# EAGLE board Reach_B0 (EAGLE 8.4.2)
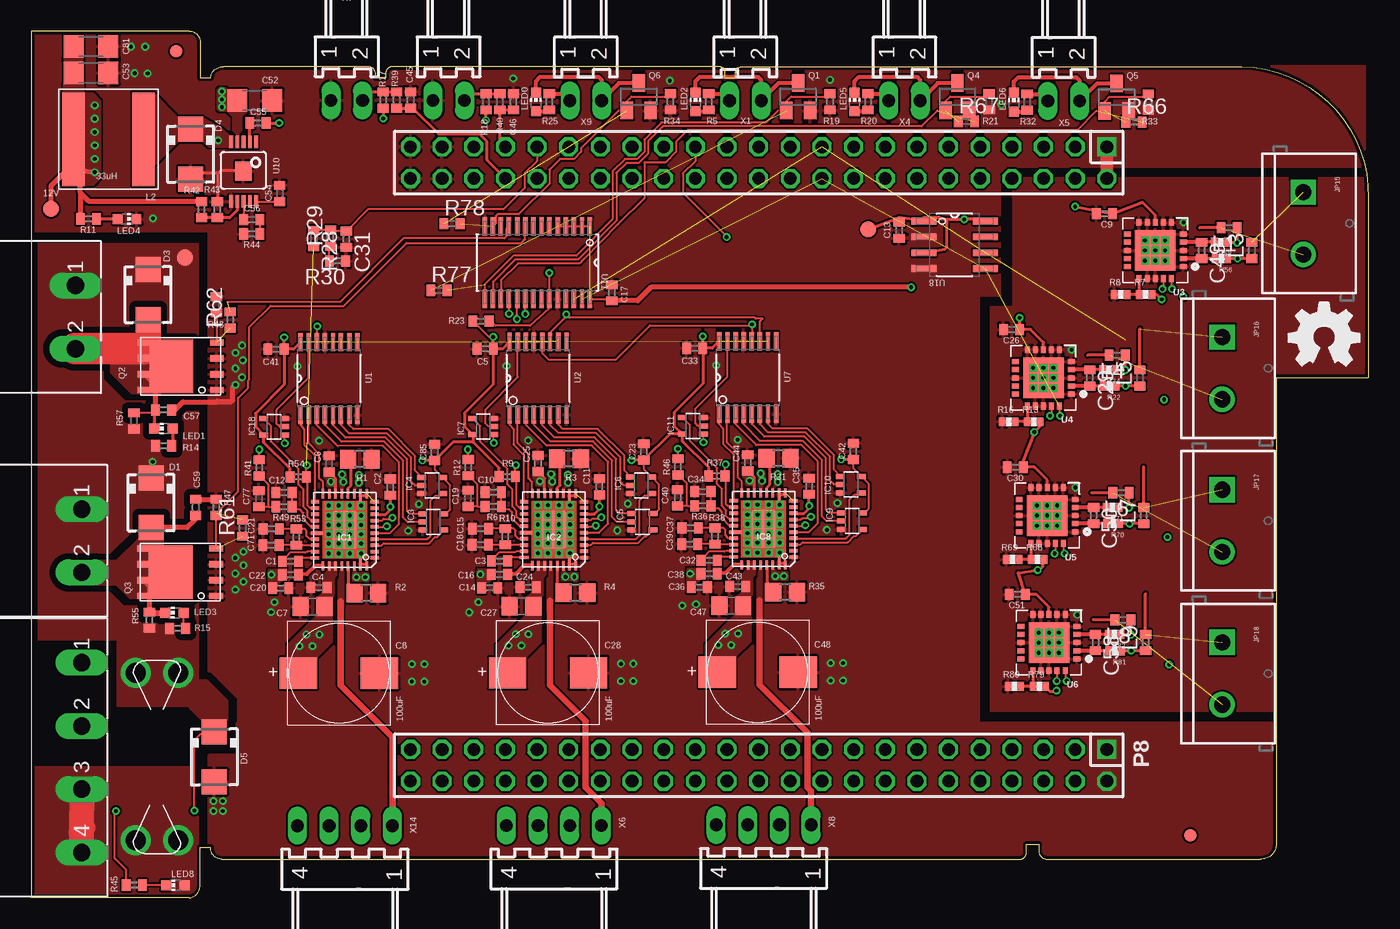
[diagram p5: board, top side]
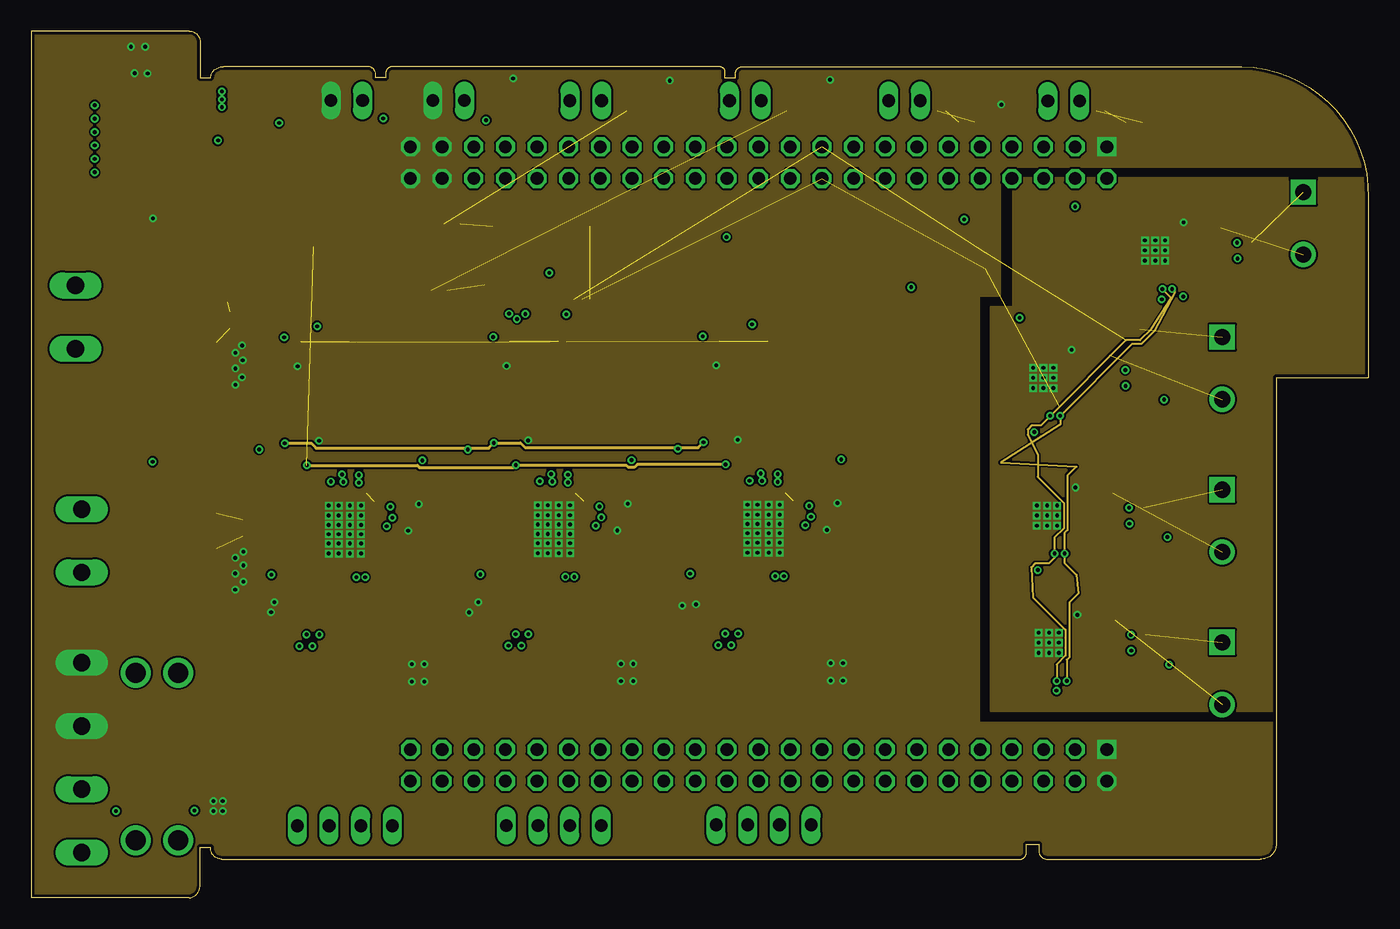
[diagram p6: board, inner layer GND]
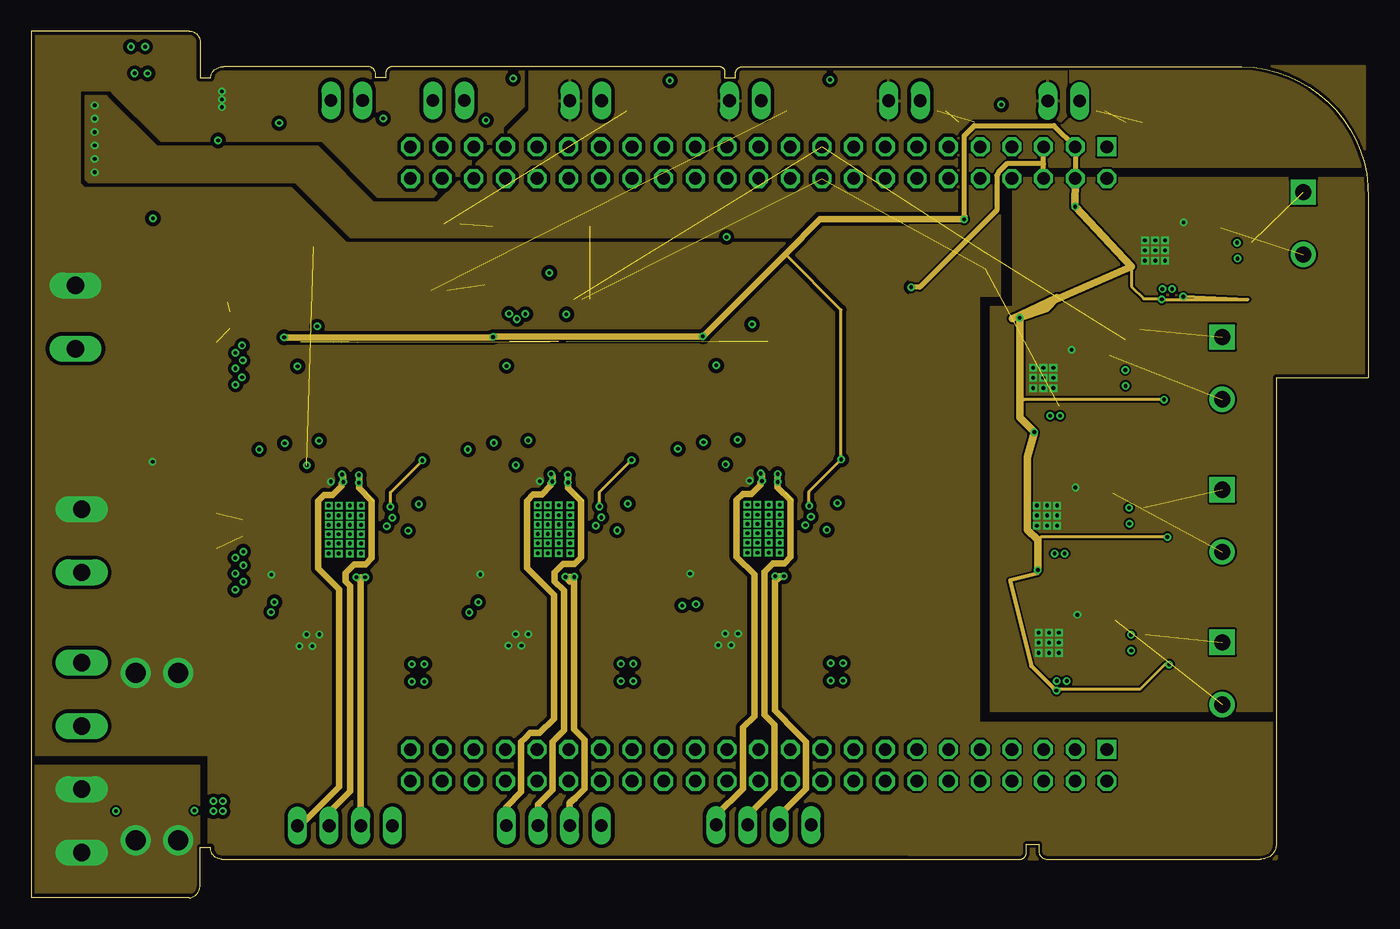
[diagram p7: board, inner layer VCC]
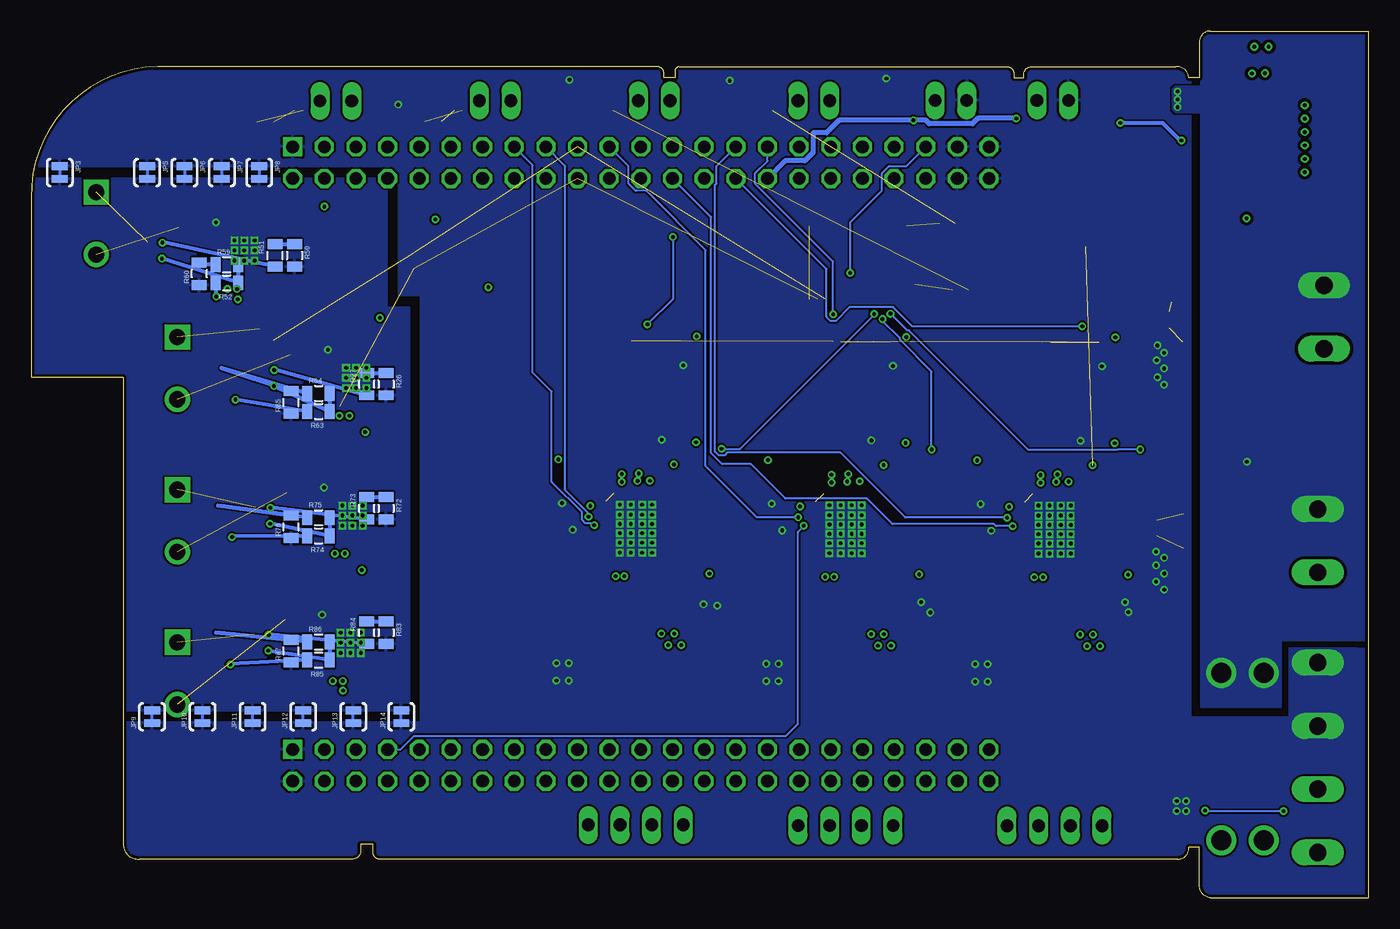
[diagram p8: board, bottom side, seen from below]

Size 107.3 x 69.55 mm. Coordinates in mm from the lower left corner, seen from the top.
Outline: 13.55,4.05 14.4,4.05 14.4,3.95 arc90 15.3,3.1 79.45,3.1 arc90 79.85,3.75 79.85,4.3 80.85,4.3 80.85,3.85 arc90 81.45,3.1 98.65,3.1 arc90 99.9,4.2 99.9,41.75 107.3,41.75 107.3,56.2 arc90 97.15,66.7 57.02,66.7 arc90 56.52,66.15 56.52,65.8 55.65,65.8 55.65,66.3 arc90 55.3,66.7 29,66.7 arc90 28.45,66.2 28.45,65.8 27.65,65.8 27.65,66.05 arc90 27.05,66.7 15.45,66.7 arc90 14.4,65.8 13.55,65.8 13.55,68.75 arc90 12.7,69.55 0,69.55 0,0 12.7,0 arc90 13.55,1.05 13.55,4.05
Copper layers (1*2*3*16): Top 0.035mm / dielectric 0.2mm / GND 0.035mm / dielectric 1.1mm / VCC 0.035mm / dielectric 0.2mm / Bottom 0.035mm
Design rules "default *": minimum track width 6mil, minimum drill 0.3mm, track to track 6mil, track to pad 6mil, pad to pad 6mil, via to via 6mil, smd to smd 0mil, copper to edge 10mil, drill to drill 10mil, minimum pad ring 10mil, minimum via ring 6mil, stop-mask expansion 2mil, vias tented up to drill 100mil, thermal gap 8mil
Net classes: 1 power: width 1.27 mm; 2 Stepper: width 0.508 mm, clearance 0.305 mm

## Footprints (pad centres in the part's own frame; a part is rotated, then mirrored left to right if it is on the bottom)
B1,27 = smd 1.27 x 1.27: TP 0,0
C0402 = smd 0.7 x 0.9: 1 -0.65,0; 2 0.65,0
C0805 = smd 1.3 x 1.5: 1 -0.95,0; 2 0.95,0
RHS1V10MCN1GS = smd 3 x 2.5: + -3.25,0; - 3.25,0
C1206 = smd 1.6 x 1.8: 1 -1.4,0; 2 1.4,0
SMA = smd 2 x 2: A 2,0; C -2,0
3557 = drill 1.6: P$1 -6.73,1.7; P$2 -6.73,-1.7; P$3 6.73,-1.7; P$4 6.73,1.7
QFN36 = smd 0.7 x 0.25: 1 -2.4,2.25; 2 -2.4,1.75; 3 -2.4,1.25; 4 -2.4,0.75; 5 -2.4,0.25; 6 -2.4,-0.25; 7 -2.4,-0.75; 8 -2.4,-1.25; 9 -2.4,-1.75; 10 -2.4,-2.25; 19 2.4,-2.25; 20 2.4,-1.75; 21 2.4,-1.25; 22 2.4,-0.75; 23 2.4,-0.25; 25 2.4,0.75; 26 2.4,1.25; 27 2.4,1.75; 28 2.4,2.25 | smd 0.25 x 0.7: 11 -1.75,-2.9; 13 -0.75,-2.9; 14 -0.25,-2.9; 15 0.25,-2.9; 16 0.75,-2.9; 17 1.25,-2.9; 18 1.75,-2.9; 29 1.75,2.9; 30 1.25,2.9; 31 0.75,2.9; 32 0.25,2.9; 33 -0.25,2.9; 34 -0.75,2.9; 36 -1.75,2.9 | smd 0.25 x 1: 12 -1.25,-2.75; 35 -1.25,2.75 | smd 1 x 0.25: 24 2.25,0.25 | smd 2 x 3: TP 0,0
SC70-5 = smd 0.4 x 0.7: 1 -0.65,-0.85; 2 0,-0.85; 3 0.65,-0.85; 4 0.65,0.85; 5 -0.65,0.85
FIDUCIAL-1X2.5 = smd 1 x 1: 1 0,0
PAD-JUMPER-2-NC_BY_TRACE_YES_SILK = smd 0.635 x 1.27: 1 -0.508,0; 2 0.508,0
SCREWTERMINAL-5MM-2 = drill 1.3 pad 2.032 square: 1 0,0 | drill 1.3 pad 2.032: 2 5,0
0402 = smd 0.7 x 0.9: 1 -0.65,0; 2 0.65,0
NR8040T330 = smd 1.8 x 7.5: P$1 2.8,0; P$2 -2.8,0
CHIP-LED0603 = smd 0.8 x 0.8: A 0,-0.75; C 0,0.75
DIL-100-2X23 = drill 1.016 square: 1 -27.94,-1.27 | drill 1.016 octagon: 2 -27.94,1.27; 3 -25.4,-1.27; 4 -25.4,1.27; 5 -22.86,-1.27; 6 -22.86,1.27; 7 -20.32,-1.27; 8 -20.32,1.27; 9 -17.78,-1.27; 10 -17.78,1.27; 11 -15.24,-1.27; 12 -15.24,1.27; 13 -12.7,-1.27; 14 -12.7,1.27; 15 -10.16,-1.27; 16 -10.16,1.27; 17 -7.62,-1.27; 18 -7.62,1.27; 19 -5.08,-1.27; 20 -5.08,1.27; 21 -2.54,-1.27; 22 -2.54,1.27; 23 0,-1.27; 24 0,1.27; 25 2.54,-1.27; 26 2.54,1.27; 27 5.08,-1.27; 28 5.08,1.27; 29 7.62,-1.27; 30 7.62,1.27; 31 10.16,-1.27; 32 10.16,1.27; 33 12.7,-1.27; 34 12.7,1.27; 35 15.24,-1.27; 36 15.24,1.27; 37 17.78,-1.27; 38 17.78,1.27; 39 20.32,-1.27; 40 20.32,1.27; 41 22.86,-1.27; 42 22.86,1.27; 43 25.4,-1.27; 44 25.4,1.27; 45 27.94,-1.27; 46 27.94,1.27
SOT23 = smd 1 x 1.4: 1 -0.95,-1.1; 2 0.95,-1.1; 3 0,1.1
8-DFN-EP-(5X6) = smd 1.1 x 0.5: 1 -2.9,1.905; 2 -2.9,0.635; 3 -2.9,-0.635; 4 -2.9,-1.905; 5 2.9,-1.905; 6 2.9,-0.635; 7 2.9,0.635; 8 2.9,1.905 | smd 3.5 x 4.3: TH 0.75,0
R0805 = smd 1.3 x 1.5: 1 -0.95,0; 2 0.95,0
R0402 = smd 0.7 x 0.9: 1 -0.65,0; 2 0.65,0
0402-RES = smd 0.6 x 0.7: 1 -0.508,0; 2 0.508,0
0805 = smd 0.8 x 1.2: 1 -0.9,0; 2 0.9,0
SOP65P640X120-16N = smd 1.473 x 0.356: 1 -2.921,2.286; 2 -2.921,1.626; 3 -2.921,0.965; 4 -2.921,0.33; 5 -2.921,-0.33; 6 -2.921,-0.965; 7 -2.921,-1.626; 8 -2.921,-2.286; 9 2.921,-2.286; 10 2.921,-1.626; 11 2.921,-0.965; 12 2.921,-0.33; 13 2.921,0.33; 14 2.921,0.965; 15 2.921,1.626; 16 2.921,2.286
MQFN-20 = smd 0.55 x 0.4: P$1 -2.25,1.3; P$2 -2.25,0.65; P$3 -2.25,0; P$4 -2.25,-0.65; P$5 -2.25,-1.3; P$11 2.25,-1.3; P$12 2.25,-0.65; P$13 2.25,0; P$14 2.25,0.65; P$15 2.25,1.3 | smd 0.4 x 0.55: P$6 -1.3,-2.25; P$7 -0.65,-2.25; P$8 0,-2.25; P$9 0.65,-2.25; P$10 1.3,-2.25; P$16 1.3,2.25; P$17 0.65,2.25; P$18 0,2.25; P$19 -0.65,2.25; P$20 -1.3,2.25 | smd 3.25 x 3.25: P$21 0,0
MSOP10 = smd 0.3 x 1: 1 -1,-2.4; 2 -0.5,-2.4; 3 0.005,-2.4; 4 0.5,-2.4; 5 1,-2.4; 6 1,2.4; 7 0.5,2.4; 8 0.005,2.4; 9 -0.5,2.4; 10 -1,2.4 | smd 1.3 x 1.5: EP 0.02,-0.04
SOP65P640X110-28N = smd 1.473 x 0.356: 1 -2.921,4.216; 2 -2.921,3.581; 3 -2.921,2.921; 4 -2.921,2.286; 5 -2.921,1.626; 6 -2.921,0.965; 7 -2.921,0.33; 8 -2.921,-0.33; 9 -2.921,-0.965; 10 -2.921,-1.626; 11 -2.921,-2.286; 12 -2.921,-2.921; 13 -2.921,-3.581; 14 -2.921,-4.216; 15 2.921,-4.216; 16 2.921,-3.581; 17 2.921,-2.921; 18 2.921,-2.286; 19 2.921,-1.626; 20 2.921,-0.965; 21 2.921,-0.33; 22 2.921,0.33; 23 2.921,0.965; 24 2.921,1.626; 25 2.921,2.286; 26 2.921,2.921; 27 2.921,3.581; 28 2.921,4.216
SOIC127P600X175-8N = smd 1.981 x 0.533: 1 -2.464,1.905; 2 -2.464,0.635; 3 -2.464,-0.635; 4 -2.464,-1.905; 5 2.464,-1.905; 6 2.464,-0.635; 7 2.464,0.635; 8 2.464,1.905
7395-02 = drill 1.016 long: 1 1.27,0; 2 -1.27,0
MSTBA4 = drill 1.397 long: 1 -7.62,5.08; 2 -2.54,5.08; 3 2.54,5.08; 4 7.62,5.08
MSTBA2 = drill 1.397 long: 1 -2.54,5.08; 2 2.54,5.08
7395-04 = drill 1.016 long: 1 3.81,0; 2 1.27,0; 3 -1.27,0; 4 -3.81,0

## Placement (x,y rotation side)
3.3V  TPB1,27  [B1,27]  67.17,53.65 0 top
12..24V  TPB1,27  [B1,27]  12.32,51.38 90 top
12V  TPB1,27  [B1,27]  1.6,55.27 0 top
C1  22nF  [C0402]  20.8,27 180 top
C2  0.1uF  [C0402]  28.82,32.95 90 top
C3  22nF  [C0402]  37.58,27.02 180 top
C4  0.1uF  [C0402]  23.1,24.9 180 top
C5  0.1uF  [C0402]  36.42,44.05 180 top
C6  0.1uF  [C0402]  23.9,34.83 90 top
C7  10uF  [C0805]  22.57,23.38 180 top
C8  100uF  [RHS1V10MCN1GS]  24.7,18.02 0 top
C9  0.1uF  [C0402]  86.12,54.9 180 top
C10  4.7uF  [C0402]  37.08,32.55 180 top
C11  0.1uF  [C0402]  45.6,32.98 90 top
C12  4.7uF  [C0402]  20.3,32.52 180 top
C13  0.1uF  [C0402]  69.65,53.58 270 top
C14  0.1uF  [C0402]  36.8,24.88 180 top
C15  4.7uF  [C0402]  36.05,29.62 0 top
C16  0.1uF  [C0402]  37.58,25.95 180 top
C17  0.1uF  [C0402]  46.59,48.55 90 top
C18  0.1uF  [C0402]  36.02,28.32 180 top
C19  4.7uF  [C0402]  35.05,32.05 90 top
C20  0.1uF  [C0402]  20.02,24.85 180 top
C21  4.7uF  [C0402]  19.27,29.6 0 top
C22  0.1uF  [C0402]  20.8,25.93 180 top
C23  0.1uF  [C0402]  49.15,35.77 90 top
C24  0.1uF  [C0402]  39.88,24.93 180 top
C25  0.1uF  [C0402]  40.67,34.85 90 top
C26  0.1uF  [C0402]  78.67,45.6 180 top
C27  10uF  [C0805]  39.35,23.4 180 top
C28  100uF  [RHS1V10MCN1GS]  41.48,18.05 0 top
C29  0.1uF  [C0402]  84.95,41.73 270 top
C30  0.1uF  [C0402]  78.97,34.55 180 top
C31  4.7uF  [C0402]  25.3,52.85 270 top
C32  22nF  [C0402]  54.4,27.07 180 top
C33  0.1uF  [C0402]  53.25,44.1 180 top
C34  4.7uF  [C0402]  53.9,32.6 180 top
C35  0.1uF  [C0402]  62.42,33.02 90 top
C36  0.1uF  [C0402]  53.62,24.93 180 top
C37  4.7uF  [C0402]  52.88,29.68 0 top
C38  0.1uF  [C0402]  54.4,26 180 top
C39  0.1uF  [C0402]  52.85,28.38 180 top
C40  4.7uF  [C0402]  51.88,32.1 90 top
C41  0.1uF  [C0402]  19.65,44.02 180 top
C42  0.1uF  [C0402]  65.97,35.83 90 top
C43  0.1uF  [C0402]  56.7,24.98 180 top
C44  0.1uF  [C0402]  57.5,34.9 90 top
C45  4.7uF  [C0402]  30.45,64.03 90 top
C46  4.7uF  [C0402]  38.7,63.88 90 top
C47  10uF  [C0805]  56.17,23.45 180 top
C48  100uF  [RHS1V10MCN1GS]  58.3,18.1 0 top
C49  0.1uF  [C0402]  93.92,51.95 270 top
C50  0.1uF  [C0402]  85.25,30.68 270 top
C51  0.1uF  [C0402]  79.12,24.35 180 top
C52  10uF  [C1206]  17.95,63.98 0 top
C53  10uF  [C1206]  4.8,66.2 0 top
C54  10nF  [C0402]  19.95,56.52 90 top
C55  10nF  [C0402]  18.2,62.17 0 top
C56  1nF  [C0402]  17.7,54.42 0 top
C57  4.7nF  [C0402]  10.62,39.15 0 top
C58  0.1uF  [C0402]  85.4,20.48 270 top
C59  4.7nF  [C0402]  13.2,31.32 90 top
C71  0.1uF  [C0402]  19.25,28.3 180 top
C77  4.7uF  [C0402]  18.27,32.02 90 top
C81  10uF  [C1206]  4.8,68.33 0 top
C85  0.1uF  [C0402]  32.38,35.75 90 top
D1  MBRA340T3  [SMA]  9.62,31.7 270 top
D3  MBRA340T3  [SMA]  9.38,48.4 270 top
D4  MBRA340T3  [SMA]  12.8,59.67 270 top
D5  MBRA340T3  [SMA]  14.7,11.3 270 top
F1  FUSE  [3557]  10.1,11.33 90 top
IC1  TMC2130QFN36  [QFN36]  25.18,29.52 180 top
IC2  TMC2130QFN36  [QFN36]  41.95,29.55 180 top
IC3  74AHC1G126DCK  [SC70-5]  32.27,30.15 270 top
IC4  74AHC1G126DCK  [SC70-5]  32.17,33.08 270 top
IC5  74AHC1G126DCK  [SC70-5]  49.05,30.18 270 top
IC6  74AHC1G126DCK  [SC70-5]  48.95,33.1 270 top
IC7  74AHC1G126DCK  [SC70-5]  36.27,37.83 90 top
IC8  TMC2130QFN36  [QFN36]  58.77,29.6 180 top
IC9  74AHC1G126DCK  [SC70-5]  65.88,30.23 270 top
IC10  74AHC1G126DCK  [SC70-5]  65.78,33.15 270 top
IC11  74AHC1G126DCK  [SC70-5]  53.1,37.88 90 top
IC18  74AHC1G126DCK  [SC70-5]  19.5,37.8 90 top
JP1  FIDUCIAL1X2.5  [FIDUCIAL-1X2.5]  11.62,67.92 0 top
JP2  FIDUCIAL1X2.5  [FIDUCIAL-1X2.5]  93,5 0 top
JP3  [PAD-JUMPER-2-NC_BY_TRACE_YES_SILK]  105,58.2 270 bottom
JP5  [PAD-JUMPER-2-NC_BY_TRACE_YES_SILK]  98,58.2 270 bottom
JP6  [PAD-JUMPER-2-NC_BY_TRACE_YES_SILK]  95,58.2 270 bottom
JP7  [PAD-JUMPER-2-NC_BY_TRACE_YES_SILK]  92,58.2 270 bottom
JP8  [PAD-JUMPER-2-NC_BY_TRACE_YES_SILK]  89,58.2 270 bottom
JP9  [PAD-JUMPER-2-NC_BY_TRACE_YES_SILK]  97.6,14.53 90 bottom
JP10  [PAD-JUMPER-2-NC_BY_TRACE_YES_SILK]  93.55,14.53 90 bottom
JP11  [PAD-JUMPER-2-NC_BY_TRACE_YES_SILK]  89.53,14.53 90 bottom
JP12  [PAD-JUMPER-2-NC_BY_TRACE_YES_SILK]  85.47,14.53 90 bottom
JP13  [PAD-JUMPER-2-NC_BY_TRACE_YES_SILK]  81.45,14.53 90 bottom
JP14  [PAD-JUMPER-2-NC_BY_TRACE_YES_SILK]  77.6,14.53 90 bottom
JP15  [SCREWTERMINAL-5MM-2]  102.08,56.62 270 top
JP16  [SCREWTERMINAL-5MM-2]  95.58,45 270 top
JP17  [SCREWTERMINAL-5MM-2]  95.58,32.75 270 top
JP18  [SCREWTERMINAL-5MM-2]  95.58,20.5 270 top
L1  BLM15HB121SN1  [0402]  96.12,53.77 180 top
L2  33uH  [NR8040T330]  6.2,60.88 180 top
L3  BLM15HB121SN1  [0402]  97.95,51.95 90 top
L4  BLM15HB121SN1  [0402]  87.15,43.55 180 top
L5  BLM15HB121SN1  [0402]  88.97,41.73 90 top
L6  BLM15HB121SN1  [0402]  87.45,32.5 180 top
L7  BLM15HB121SN1  [0402]  89.28,30.68 90 top
L8  BLM15HB121SN1  [0402]  87.6,22.3 180 top
L9  BLM15HB121SN1  [0402]  89.42,20.48 90 top
LED0  blue  [CHIP-LED0603]  40.5,63.88 0 top
LED1  blue  [CHIP-LED0603]  10.62,37.65 90 top
LED2  blue  [CHIP-LED0603]  53.3,63.88 0 top
LED3  blue  [CHIP-LED0603]  11.5,22.88 90 top
LED4  blue  [CHIP-LED0603]  7.7,54.48 270 top
LED5  blue  [CHIP-LED0603]  66.08,63.88 0 top
LED6  blue  [CHIP-LED0603]  78.85,63.85 0 top
LED8  blue  [CHIP-LED0603]  11.57,1 90 top
LOGO1  OSHW_LOGO_FILLX0200-NT  [OSHW_FILLX200_NOTEXT]  100.91,42.71 0 top
P8  F-2X23-  [DIL-100-2X23]  58.38,10.62 180 top
P9  F-2X23-  [DIL-100-2X23]  58.38,59 180 top
Q1  [SOT23]  61.55,64.28 0 top
Q2  AON6758  [8-DFN-EP-(5X6)]  12,42.65 180 top
Q3  AON6758  [8-DFN-EP-(5X6)]  11.95,26.12 180 top
Q4  [SOT23]  74.33,64.28 0 top
Q5  [SOT23]  87.1,64.25 0 top
Q6  [SOT23]  48.75,64.28 0 top
R1  0.1R  [R0805]  26.38,35.2 180 top
R2  0.1R  [R0805]  26.9,24.45 180 top
R3  0.1R  [R0805]  43.15,35.23 180 top
R4  0.1R  [R0805]  43.67,24.48 180 top
R5  4.7K  [R0402]  54.38,63.88 90 top
R6  10K  [R0402]  37.08,31.4 180 top
R7  DNP  [0402-RES]  89.42,48.42 0 top
R8  0  [0402-RES]  87.42,48.42 0 top
R9  4.7K  [R0402]  38.2,33.8 180 top
R10  2.2R  [R0402]  38.05,28.98 270 top
R11  4.7K  [R0402]  4.6,54.48 180 top
R12  10K  [R0402]  35.08,34.52 90 top
R13  10k  [0402-RES]  80.45,38.2 0 top
R14  4.7K  [R0402]  10.62,36.27 180 top
R15  4.7K  [R0402]  11.75,21.62 180 top
R16  2.2k  [0402-RES]  78.45,38.2 0 top
R17  4K7, 1%  [R0402]  28.25,64.03 270 top
R18  4K7, 1%  [R0402]  36.5,63.88 270 top
R19  4.7K  [R0402]  64.1,63.88 90 top
R20  4.7K  [R0402]  67.15,63.88 90 top
R21  4.7K  [R0402]  76.88,63.88 90 top
R22  100  [0402-RES]  86.53,41.08 180 top
R23  4.7K  [R0402]  36.1,46.27 180 top
R24  100  [0402-RES]  86.47,42.38 180 top
R25  4.7K  [R0402]  41.58,63.88 90 top
R26  10k  [0805]  78.83,41.23 270 bottom
R27  10k  [0805]  80.38,41.23 90 bottom
R28  10k  [R0402]  22.68,52.9 270 top
R29  7.5k  [R0402]  24.02,52.92 90 top
R30  4.3k  [R0402]  24.57,51.1 180 top
R31  0.1R  [R0805]  59.98,35.27 180 top
R32  4.7K  [R0402]  79.92,63.85 90 top
R33  4.7K  [R0402]  89.65,63.85 90 top
R34  4.7K  [R0402]  51.3,63.88 90 top
R35  0.1R  [R0805]  60.5,24.52 180 top
R36  10K  [R0402]  53.9,31.45 180 top
R37  4.7K  [R0402]  55.02,33.85 180 top
R38  2.2R  [R0402]  54.88,29.02 270 top
R39  10K  [R0402]  29.32,64.03 270 top
R40  10K  [R0402]  37.6,63.88 270 top
R41  10K  [R0402]  18.3,34.5 90 top
R42  120K,1%  [R0402]  13.68,55.23 270 top
R43  10K,1%  [R0402]  14.95,55.23 90 top
R44  39K  [R0402]  17.7,53.27 180 top
R45  4.7K  [R0402]  8.28,1.02 0 top
R46  10K  [R0402]  51.9,34.58 90 top
R47  4.7K  [R0402]  14.85,31.32 270 top
R48  4.7K  [R0402]  14.88,47.6 270 top
R49  10K  [R0402]  20.3,31.38 180 top
R50  10k  [0805]  86.17,51.55 270 bottom
R51  10k  [0805]  87.72,51.55 90 bottom
R52  10k  [0805]  91.6,49.35 0 bottom
R53  2.2R  [R0402]  21.27,28.95 270 top
R54  4.7K  [R0402]  21.43,33.77 180 top
R55  4.7K  [R0402]  9.5,22.27 270 top
R56  100  [0402-RES]  95.5,51.3 180 top
R57  4.7K  [R0402]  8.25,38.27 270 top
R58  100  [0402-RES]  95.45,52.6 180 top
R59  10k  [0805]  91.6,50.8 0 bottom
R60  10k  [0805]  93.8,50.08 90 bottom
R61  330  [R0402]  16.98,29.68 90 top
R62  330  [R0402]  15.97,46.38 90 top
R63  10k  [0805]  84.25,39.02 0 bottom
R64  10k  [0805]  84.25,40.48 0 bottom
R65  10k  [0805]  86.45,39.75 90 bottom
R66  330  [R0402]  88.5,62.25 0 top
R67  330  [R0402]  75.05,62.3 0 top
R68  10k  [0402-RES]  80.75,27.15 0 top
R69  4.3k  [0402-RES]  78.75,27.15 0 top
R70  100  [0402-RES]  86.83,30.02 180 top
R71  100  [0402-RES]  86.78,31.32 180 top
R72  10k  [0805]  78.83,31.25 270 bottom
R73  10k  [0805]  80.38,31.25 90 bottom
R74  10k  [0805]  84.25,29.05 0 bottom
R75  10k  [0805]  84.25,30.5 0 bottom
R76  10k  [0805]  86.45,29.77 90 bottom
R77  330  [R0402]  32.73,48.75 0 top
R78  330  [R0402]  33.77,54.1 0 top
R79  10k  [0402-RES]  80.9,16.95 0 top
R80  7.5k  [0402-RES]  78.9,16.95 0 top
R81  100  [0402-RES]  86.97,19.82 180 top
R82  100  [0402-RES]  86.92,21.12 180 top
R83  10k  [0805]  78.83,21.27 270 bottom
R84  10k  [0805]  80.38,21.27 90 bottom
R85  10k  [0805]  84.25,19.07 0 bottom
R86  10k  [0805]  84.25,20.52 0 bottom
R87  10k  [0805]  86.45,19.8 90 bottom
U1  SN74AHC595PW  [SOP65P640X120-16N]  23.9,41.67 90 top
U2  SN74AHC595PW  [SOP65P640X120-16N]  40.67,41.7 90 top
U3  MCP9600  [MQFN-20]  90.2,51.95 180 top
U4  MCP9600  [MQFN-20]  81.22,41.73 180 top
U5  MCP9600  [MQFN-20]  81.53,30.68 180 top
U6  MCP9600  [MQFN-20]  81.67,20.48 180 top
U7  SN74AHC595PW  [SOP65P640X120-16N]  57.5,41.75 90 top
U10  RT8268  [MSOP10]  17.05,58.27 180 top
U11  PCA9685PW  [SOP65P640X110-28N]  40.62,50.98 270 top
U18  CAT24C256  [SOIC127P600X175-8N]  74.1,52.4 0 top
U$1  [LOGO_BIG]  116.27,46.77 0 top  (outside the outline)
U$4  CC-BY-SA  [CC-BY-SA]  119.08,59.25 0 top  (outside the outline)
X1  22-05-7028-02  [7395-02]  57.3,63.98 180 top
X2  MSTBA4  [MSTBA4]  -1.02,11.25 270 top
X3  MSTBA2  [MSTBA2]  -1.02,28.65 270 top
X4  22-05-7028-02  [7395-02]  70.08,63.98 180 top
X5  22-05-7028-02  [7395-02]  82.85,63.95 180 top
X6  22-05-7048-04  [7395-04]  41.95,5.8 0 top
X7  22-05-7028-02  [7395-02]  25.32,64 180 top
X8  22-05-7048-04  [7395-04]  58.77,5.85 0 top
X9  22-05-7028-02  [7395-02]  44.5,63.98 180 top
X11  22-05-7028-02  [7395-02]  33.5,64 180 top
X14  22-05-7048-04  [7395-04]  25.18,5.78 0 top
X21  MSTBA2  [MSTBA2]  -1.52,46.6 270 top

## Tracks (layer width: path | path; a pad name or v marks a point on that pad's centre or on a via)
+3V3  (via drill 0.3)  (3 unrouted)
  Top 0.152: IC3.5 33.27,30.8 33.62,31.15 33.62,33.12 IC4.5 32.38,34.38 C85.1 | IC5.5 50.05,30.82 50.4,31.18 50.4,33.15 IC6.5 49.15,34.4 C23.1 | IC9.5 66.88,30.88 67.22,31.23 67.22,33.2 IC10.5 65.97,34.45 C42.1 | v37.08,45 36.73,45 R23.2
  Top 0.254: IC1.8 28.43,30.77 28.82,31.18 v28.82,31.38 C2.1 | C41.1 21.04,44.02 U1.16 | C41.1 20.3,41.17 18,38.88 18,37.8 IC18.5 18.68,37.12 18.68,36.55 20.77,34.45 R54.2 | U3.P$8 90.2,54.8 89.17,55.83 C9.1 v83.78,55.48 | U4.P$8 81.22,44.58 80.2,45.6 C26.1 v79.33,46.55 | U5.P$8 81.53,33.52 80.5,34.55 C30.1 79.62,35.12 v80.5,37.38 80.96,37.83 R13.2 | U6.P$8 81.67,23.32 80.65,24.35 C51.1 79.2,26.07 v80.78,26.3 80.9,26.3 81.2,26.6 81.2,27.09 R68.2 | U18.8 76.36,54.45 v74.88,54.45 73.3,54.45 | 73.3,54.45 73.05,54.45 72.92,54.58 71.57,54.58 U18.1 69.66,54.58 C13.1 69.62,54.6 3.3V.TP | U18.3 73.31,52.04 73.5,52.23 73.5,54.25 73.3,54.45 | R79.2 81.41,16.89 81.75,16.55 82.2,16.55 v82.28,16.62 | R7.2 90.33,48.42 v90.72,48.02 | C41.1 v20.3,44.98 | v31.4,35.1 C85.1 33.85,36.58 35.45,36.58 | IC2.8 45.2,30.8 45.6,31.2 v45.6,31.4 C11.1 | C5.1 37.82,44.05 U2.16 | C5.1 37.08,41.2 34.77,38.9 34.77,37.83 IC7.5 35.45,37.15 35.45,36.58 | R9.2 37.55,34.48 35.45,36.58 | C5.1 v37.08,45 | v48.17,35.12 C23.1 51.25,37.23 IC11.5 | IC8.8 62.02,30.85 62.42,31.25 v62.42,31.45 C35.1 | C33.1 54.64,44.1 U7.16 | IC11.5 51.6,37.88 51.6,38.95 53.9,41.25 C33.1 | R37.2 54.38,34.52 52.27,36.62 52.27,37.2 IC11.5 | C33.1 v53.9,45.05 | C42.1 v65,35.17 | U1.10
  VCC 0.254: 88.3,50.65 88.3,49.05 89.28,48.08 90.67,48.08 v90.72,48.02 97.65,48.02 v92.45,48.25 | v90.9,39.98 79.67,39.98 79.33,40.33 | v91.17,28.95 81.02,28.95 80.78,28.7 | v91.33,18.73 90.97,18.73 88.97,16.73 82.38,16.73 v82.28,16.62 | v28.82,31.38 28.82,32.52 v31.4,35.1 | v45.6,31.4 45.6,32.55 v48.17,35.12 | v62.42,31.45 62.42,32.6 v65,35.17 65,47.17 60.51,51.66
  VCC 0.305: v80.78,26.3 80.78,26.03 78.54,25.48 80.24,18.6 82.05,16.79 82.11,16.79 v82.28,16.62
  VCC 0.406: 74.88,54.67 74.88,61.17 75.67,61.98 82.07,61.98 P9.3 P9.4
  VCC 0.508: 74.88,54.67 v74.88,54.45 63.3,54.45 60.51,51.66 v53.9,45.05 37.12,45.05 v37.08,45 37.05,44.98 v20.3,44.98
  VCC 0.61: v80.78,26.3 80.78,28.7 79.94,29.54 79.94,35.39 80.5,37.32 v80.5,37.38 79.33,38.55 79.33,40.33 v79.33,46.55 81.45,47.27 82.33,48.15 78.72,46.5 88.3,50.65 v83.78,55.48 v83.77,55.48 P9.4
  Bottom 0.305: R85.1 91.35,18.75 v91.33,18.73 | R74.1 91.2,28.98 v91.17,28.95 | R63.1 v90.9,39.98 | R52.1 92.5,48.3 v92.45,48.25
B_A3  (via drill 0.3)
  VCC 0.508: 43.22,25.41 v42.88,25.75 v43.58,25.75 43.58,13.5 44.41,12.67 44.41,11.85 | X6.2 43.22,7.61 43.44,7.83 43.68,8.03 44.41,8.76 44.41,11.85 | 44.41,11.85 44.4,11.85
  pour Top (rank 4, no thermals): 42.6,26.32 42.6,26.18 42.5,26.07 42.5,25.48 42.58,25.4 43.85,25.4 43.92,25.48 43.92,26.02 43.83,26.12 42.98,26.12 42.8,26.32
B_A4
  Top 0.508: 41.62,23.82 41.62,17.05 44.48,14.2 44.48,8.85 45.76,7.57 X6.1
  pour Top (rank 4, no thermals): 41.88,23.4 41.88,26.23 41.8,26.32 41.6,26.32 41.52,26.25 41.52,26.1 41.5,26.05 41.5,25.77 41.38,25.55 41.38,23.02 41.52,23.02
B_B3  (via drill 0.3)
  VCC 0.508: v41.73,34 41.83,33.9 v41.83,33.4 41.69,33.26 41.69,33.07 40.98,32.36 40.29,32.36 39.79,31.86 39.79,26.47 41.95,24.31 41.95,14.37 40.79,13.22 40.05,13.22 39.66,12.82 39.3,12.5 39.33,8.5 38.14,7.32 X6.4
  pour Top (rank 4, no thermals): 41.6,32.77 41.6,32.9 41.52,32.98 41.52,33.73 41.4,33.95 41.48,34.27 42.02,34.27 42.08,33.65 42.12,33.38 42.05,33.2 41.92,33.1 41.85,33.02 41.8,32.77
B_B4  (via drill 0.3)
  VCC 0.508: v43.08,33.95 v43.08,33.33 43.08,32.89 44.11,31.86 44.11,27.29 43.61,26.79 42.7,26.79 42.01,26.11 42.01,25.39 42.76,24.64 42.76,13.44 41.85,12.53 41.85,8.65 40.68,7.48 X6.3
  pour Top (rank 4, no thermals): 42.8,32.77 42.8,32.8 43.02,33.02 43.2,33.02 43.4,33.23 43.4,34.05 43.2,34.25 42.95,34.25 42.77,34.08 42.77,33.02 42.6,32.77
C_A3  (via drill 0.3)
  VCC 0.508: v60.4,25.8 v59.7,25.8 60.15,25.8 59.7,25.41 59.7,15.03 61.46,13.22 62.16,12.52 62.19,12.52 | X8.2 60.05,6.62 62.19,8.76 62.19,12.52 | 62.19,12.52 62.17,12.53
  pour Top (rank 4, no thermals): 59.42,26.38 59.42,26.23 59.33,26.12 59.33,25.52 59.4,25.45 60.67,25.45 60.75,25.52 60.75,26.07 60.65,26.18 59.8,26.18 59.62,26.38
C_A4
  Top 0.508: 58.45,23.88 58.45,17.1 62.29,13.26 62.29,8.87 62.59,8.57 X8.1
  pour Top (rank 4, no thermals): 58.7,23.45 58.7,26.27 58.62,26.38 58.42,26.38 58.35,26.3 58.35,26.15 58.33,26.1 58.33,25.82 58.2,25.6 58.2,23.07 58.35,23.07
C_B3  (via drill 0.3)
  VCC 0.508: 55.45,5.85 X8.4 | X8.4 55.2,5.85 | v58.55,34.05 58.65,33.95 v58.65,33.45 58.51,33.31 58.51,33.12 57.8,32.41 57.12,32.41 56.61,31.91 56.61,27.34 58.03,25.93 58.03,14.58 57.1,13.65 57.1,8.76 54.97,6.62 X8.4
  pour Top (rank 4, no thermals): 58.42,32.83 58.42,32.95 58.35,33.02 58.35,33.77 58.23,34 58.3,34.33 58.85,34.33 58.9,33.7 58.95,33.42 58.88,33.25 58.75,33.15 58.67,33.08 58.62,32.83
C_B4  (via drill 0.3)
  VCC 0.508: v59.9,34 v59.9,33.38 59.9,32.94 60.94,31.91 60.94,27.34 60.43,26.84 59.52,26.84 58.84,26.16 58.84,14.69 59.65,13.88 59.65,12.7 | X8.3 57.51,6.62 59.65,8.76 59.65,12.7 | 59.65,12.7
  pour Top (rank 4, no thermals): 59.62,32.83 59.62,32.85 59.85,33.08 60.02,33.08 60.23,33.27 60.23,34.1 60.02,34.3 59.77,34.3 59.6,34.12 59.6,33.08 59.42,32.83
DIR_A  (via drill 0.3)
  Top 0.152: IC1.7 28.15,30.27 28.27,30.4 28.88,30.4 v28.98,30.5
  Bottom 0.152: v28.98,30.5 37.15,30.5 42.37,35.72 51.45,35.72 51.68,35.49 52.12,35.49 52.43,35.8 52.43,57.19 52.3,57.32 52.3,58.72 P9.29
DIR_B  (via drill 0.3)
  Top 0.152: IC2.7 44.92,30.3 45.05,30.43 45.65,30.43 v45.75,30.52
  Bottom 0.152: v45.75,30.52 49.05,30.52 53.17,34.65 53.17,51.98 57.94,56.74 58.78,56.74 59.37,57.32 59.37,58.72 P9.21
DIR_C  (via drill 0.3)
  Top 0.152: IC8.7 61.75,30.35 61.88,30.48 62.48,30.48 v62.58,30.57
  Bottom 0.152: v62.58,30.57 62.58,30.85 64.45,32.72 64.45,58.72 P9.17
ENABLE  (via drill 0.3)
  Top 0.152: R23.1 36.89,46.27 37.25,45.91 40.05,45.91 41.59,47.32 41.59,47.92 U11.23 41.59,50.11 41.58,50.12 v41.58,50.15
  Bottom 0.152: v41.58,50.15 41.58,54.21 39.05,56.74 39.05,58.14 38.47,58.72 37.06,58.72 P9.41
ENABLE_A
  Top 0.152: IC1.22 22.45,30.27 22.18,30.55 22.18,31.02 21.85,31.38 21.85,32.75 21.45,33.15 21.45,34.4 19.25,36.6 19.25,37.85 IC18.4
ENABLE_B
  Top 0.152: IC2.22 39.23,30.3 38.95,30.57 38.95,31.05 38.62,31.4 38.62,32.77 38.23,33.17 38.23,34.42 36.02,36.62 36.02,37.88 IC7.4
ENABLE_C
  Top 0.152: IC8.22 56.05,30.35 55.77,30.62 55.77,31.1 55.45,31.45 55.45,32.83 55.05,33.23 55.05,34.48 52.85,36.67 52.85,37.92 IC11.4
FAN4  (1 unrouted)
  Top 0.152: U11.13 37.3,54.15 37.3,54.73 37.43,54.86 39.13,54.86 41.59,57.32 41.59,58.44 42.43,59.28 43.55,59.28 44.13,59.86 44.13,60.17 47.13,63.17
FAN5  (1 unrouted)
  Top 0.152: 59.93,63.17 58.98,62.22 50.58,62.22 49.21,60.85 49.21,59.86 48.62,59.28 47.63,59.28 46.67,58.31 46.67,54.48 43.75,51.52 38.69,51.52 36.4,49.23 36.4,48.06 U11.15
FAN6  (1 unrouted)
  Top 0.152: 72.71,63.17 71.45,61.92 50.7,61.92 49.51,60.73 49.51,59.73 48.75,58.98 47.76,58.98 46.97,58.19 46.97,54.36 44.06,51.39 43.97,51.3 43.88,51.22 43.88,51.21 43.75,51.21 43.63,51.21 38.84,51.21 37.05,49.42 U11.16
FAN7  (1 unrouted)
  Top 0.152: 44.01,50.91 44.09,50.99 44.18,51.09 44.19,51.09 44.27,51.18 44.36,51.27 47.1,54.05 47.19,54.15 49.2,56.16 49.21,56.16 49.21,59 50.88,59 51.75,59.86 51.75,60.68 52.68,61.61 83.95,61.61 85.48,63.15 | 44.01,50.91 | 44.01,50.91 43.75,50.91 39.06,50.91 37.7,49.55 U11.17 37.74,48.09
FAULT_REACH
  Top 0.152: P9.37 40.59,59.13 39.6,58.14 39.6,56.95 37.9,55.25 27.05,55.25 C31.1 24.1,53.5 R29.2 22.7,53.58 R28.1
FAULT_X  (via drill 0.3)  (1 unrouted)
  Top 0.152: IC1.20 22.4,31.27 22.18,31.5 22.18,33.67 R54.1 22.07,34.65 v22.12,34.7 | IC2.20 39.17,31.3 38.95,31.52 38.95,33.7 R9.1 38.85,34.67 v38.9,34.73 | IC8.20 56,31.35 55.77,31.57 55.77,33.75 R37.1 55.67,34.73 v55.73,34.77
  GND 0.254: v55.73,34.77 48.65,34.77 48.42,34.54 47.93,34.54 47.75,34.73 v38.9,34.73 38.69,34.52 31.16,34.52 30.98,34.7 v22.12,34.7
GND  (via drill 0.3)  (3 unrouted)
  Top 0.152: IC1.24 23.77,29.27 v23.88,29.18 | v25.57,29.18 25.52,29.18 IC1.TP | IC1.12 26.43,31.52 v26.48,31.48 | IC2.24 40.55,29.3 v40.65,29.2 | v42.35,29.2 42.3,29.2 IC2.TP | IC2.12 43.2,31.55 v43.25,31.5 | IC8.24 57.38,29.35 v57.48,29.25 | v59.17,29.25 59.12,29.25 IC8.TP | IC8.12 60.02,31.6 v60.08,31.55
  Top 0.254: 14.95,58.1 R43.2 | 14.95,58.1 15.25,58.4 16.95,58.4 U10.EP | 13.4,58.2 14.85,58.2 14.95,58.1 | IC1.12 26.77,32.27 26.93,32.42 | IC1.35 26.77,26.77 IC1.36 | IC2.12 43.55,32.3 43.7,32.45 | IC2.35 43.55,26.8 IC2.36 | IC8.12 60.38,32.35 60.52,32.5 | IC8.35 60.38,26.85 IC8.36
  Top 0.406: C59.2 R47.1 | C57.2 11.53,39.15 12.18,39.8 14.88,39.8 14.9,39.83 16.07,39.83 16.18,39.92 16.18,40.95 v16.4,41.17
  Top 1.016: P9.2 P9.1
  other vias: 17.02,25.38 16.38,24.73 16.38,26.02 17.02,26.68 16.38,27.27 17.02,27.77 9.78,54.52 16.93,41.77 16.4,42.48 16.98,43.12 16.4,43.73 16.93,44.33 26.48,27.62 25.57,27.62 26.48,29.18 26.48,30.68 26.48,28.43 25.57,29.93 25.57,28.43 25.57,30.68 25.57,31.48 24.68,27.62 24.68,28.43 23.88,29.93 24.68,29.93 23.88,28.43 24.68,31.48 23.88,30.68 24.68,30.68 30.25,29.45 23.1,36.67 21.38,42.65 14.62,7.75 15.38,7.75 14.62,6.95 15.38,6.95 26.48,29.93 23.88,27.62 24.68,29.18 23.88,31.48 30.55,18.75 30.55,17.35 31.55,18.75 31.55,17.35 31.1,31.6 43.25,27.65 42.35,27.65 43.25,29.2 43.25,30.7 43.25,28.45 42.35,29.95 42.35,28.45 42.35,30.7 42.35,31.5 41.45,27.65 41.45,28.45 40.65,29.95 41.45,29.95 40.65,28.45 41.45,31.5 40.65,30.7 41.45,30.7 47.02,29.48 39.88,36.7 38.15,42.67 43.25,29.95 40.65,27.65 41.45,29.2 40.65,31.5 47.33,18.77 47.33,17.38 48.33,18.77 48.33,17.38 47.88,31.62 60.08,27.7 59.17,27.7 60.08,29.25 60.08,30.75 60.08,28.5 59.17,30 59.17,28.5 59.17,30.75 59.17,31.55 58.27,27.7 58.27,28.5 57.48,30 58.27,30 57.48,28.5 58.27,31.55 57.48,30.75 58.27,30.75 63.85,29.52 56.7,36.75 54.98,42.73 60.08,30 57.48,27.7 58.27,29.25 57.48,31.55 64.15,18.82 64.15,17.43 65.15,18.82 65.15,17.43 64.7,31.68 77.85,63.65 64.1,65.65 51.25,65.58 38.67,65.75 8,68.3 8.3,66.17 9.15,68.3 9.35,66.15 19.52,23.73 19.25,22.93 35.88,23.73 35.15,22.9 53.35,23.55 52.25,23.45
  pour Bottom (isolate 0.152, rank 6): 76,67.15 14.3,67.15 14.3,14.5 6,14.5 6,20 0,20 0,0 76,0 arc90 76,1.2
  pour Bottom (no thermals): 0.95,20 0.95,11.95 6.3,12 6.3,20
  pour GND (no thermals): -0.4,69.75 76,69.85 76,0.1 -0.3,0
  pour Top (rank 6): 14.3,4.05 14.3,11.45 16.55,11.45 16.55,14.03 16.65,14.12 16.65,15.88 16.73,15.88 15.07,17.52 15.07,17.57 14.45,18.15 14.3,18.15 14.3,53.5 0,53.5 0,69.55 12.75,69.55 arc-90 13.55,68.75 13.55,65.8 14.4,65.8 arc-90 15.3,66.7 27.05,66.7 arc-90 27.65,66.1 27.65,65.8 28.45,65.8 28.45,66.2 arc-90 28.95,66.7 55.27,66.7 arc-90 55.65,66.33 55.65,65.8 56.52,65.8 56.52,66.2 arc-90 57.02,66.7 76,66.7 76,3.1 15.25,3.1 arc-90 14.4,3.95 14.4,4.05
  pour Top (rank 5, no thermals): 70.5,14.03 99.9,14.03 99.9,3.1 70.5,3.1
  pour Top (rank 5, no thermals): 70.47,48.38 77.75,48.38 77.75,58.05 78.4,58.7 107.03,58.7 107.03,66.7 70.5,66.7 70.5,48.4
  pour GND (rank 5, no thermals): 70.53,14.03 99.9,14.03 99.9,3.1 70.55,3.1 70.55,14
  pour GND (rank 5, no thermals): 70.47,48.38 77.75,48.38 77.75,58.25 78.2,58.7 107.03,58.7 107.03,66.7 70.5,66.7 70.5,48.4
  pour Bottom (rank 5): 70.47,14.03 99.9,14.03 99.9,3.1 70.47,3.1
  pour Bottom (rank 5): 70.5,48.38 77.75,48.38 77.75,50.38 77.75,58.25 78.12,58.62 78.15,58.65 78.17,58.67 78.2,58.7 107.03,58.7 107.03,66.7 70.5,66.7
GNDI  (via drill 0.3)
  other vias: 83.95,22.7 80.85,21.27 81.67,21.27 82.47,21.27 82.47,20.48 81.67,20.48 80.85,20.48 80.85,19.65 81.67,19.65 82.47,19.65 83.8,32.92 80.7,31.48 81.53,31.48 82.33,31.48 82.33,30.68 81.53,30.68 80.7,30.68 80.7,29.85 81.53,29.85 82.33,29.85 80.4,42.52 81.22,42.52 82.03,42.52 82.03,41.73 81.22,41.73 80.4,41.73 80.4,40.9 81.22,40.9 82.03,40.9 89.38,52.75 90.2,52.75 91,52.75 91,51.95 90.2,51.95 89.38,51.95 89.38,51.12 90.2,51.12 91,51.12 83.5,43.98 92.47,54.2
  pour Top (rank 5): 107.42,57.7 78.8,57.7 78.8,45.3 107.42,45.3
  pour GND (rank 5): 107.42,57.7 78.8,57.7 78.8,45.3 107.42,45.3
  pour Bottom (rank 5): 107.42,57.7 78.8,57.7 78.8,45.3 107.42,45.3
  pour VCC (rank 5): 107.42,57.7 78.8,57.7 78.8,45.3 107.42,45.3
  pour Top (rank 5): 100.08,47.38 77,47.38 77,34.98 100.08,34.98
  pour GND (rank 5): 100.08,47.38 77,47.38 77,34.98 100.08,34.98
  pour Bottom (rank 5): 100.08,47.38 77,47.38 77,34.98 100.08,34.98
  pour VCC (rank 5): 100.08,47.38 77,47.38 77,34.98 100.08,34.98
  pour Top (rank 5): 100.08,37.4 77,37.4 77,25 100.08,25
  pour GND (rank 5): 100.08,37.4 77,37.4 77,25 100.08,25
  pour Bottom (rank 5): 100.08,37.4 77,37.4 77,25 100.08,25
  pour VCC (rank 5): 100.08,37.4 77,37.4 77,25 100.08,25
  pour Top (rank 5): 100.08,27.43 77,27.43 77,15.03 100.08,15.03
  pour GND (rank 5): 100.08,27.43 77,27.43 77,15.03 100.08,15.03
  pour Bottom (rank 5): 100.08,27.43 77,27.43 77,15.03 100.08,15.03
  pour VCC (rank 5): 100.08,27.43 77,27.43 77,15.03 100.08,15.03
  pour Bottom (rank 5, no thermals): 100.12,41.77 100.12,45.25 107.25,45.25 107.25,41.75 100.15,41.75
  pour VCC (rank 5, no thermals): 100.08,41.75 100.08,45.3 107.3,45.3 107.3,41.75
  pour GND (rank 5, no thermals): 100.1,41.75 100.1,45.3 107.3,45.3 107.3,41.75
  pour Top (rank 5, no thermals): 100.1,41.75 100.1,45.27 107.3,45.27 107.3,41.75
HEATER_A  (1 unrouted)
  Top 0.152: 14.85,30.85 16.61,32.61 16.61,40.11 17.4,40.9 17.4,41.5 17.51,41.6 17.51,45.81 19.2,47.5 25.07,47.5 30.12,52.55 39.35,52.55 39.65,52.85 39.65,53.89 U11.9
HEATER_B  (1 unrouted)
  Top 0.152: U11.11 38.11,53.67 38.11,53.06 37.98,52.93 29.88,52.93 24.77,47.83 15.75,47.83
I2C2_SCL  (via drill 0.3)  (3 unrouted)
  Top 0.152: U6.P$19 82.33,17.43 v82.3,17.4 | U5.P$19 82.17,27.68 v82.12,27.62 | U4.P$19 81.88,38.77 v81.78,38.67 | U3.P$19 90.85,48.92 v90.78,48.85
  GND 0.152: v82.3,17.4 82.3,18.72 83.01,19.43 83.01,21.5 80.39,24.11 80.24,26.52 80.56,26.83 81.68,26.83 82.12,27.28 v82.12,27.62 82.12,28.9 82.86,29.63 82.86,31.7 80.77,33.78 80.77,35.58 79.97,37.16 79.97,37.59 80.28,37.91 81.01,37.91 v81.78,38.67 87.84,44.74 88.97,44.74 89.88,45.66 91.51,48.12 v90.78,48.85
I2C2_SDA  (via drill 0.3)  (3 unrouted)
  Top 0.152: U6.P$20 82.97,17.52 v83.1,17.4 | U5.P$20 82.83,27.73 v82.92,27.62 | U4.P$20 82.53,38.73 v82.58,38.67 | U3.P$20 91.5,48.9 v91.55,48.85
  GND 0.152: v83.1,17.4 83.1,19.09 83.31,19.3 83.31,23.68 84.03,24.41 83.88,25.92 82.92,26.88 v82.92,27.62 82.92,29.27 83.16,29.5 83.16,33.88 83.88,34.6 77.83,34.92 82.58,37.98 v82.58,38.67 88.34,44.44 89.1,44.44 90.19,45.53 91.81,48.59 v91.55,48.85
IREF_A
  Top 0.152: 19.05,31.38 R49.2 | 19.05,31.38 C77.1 | R41.1 18.35,33.85 19,33.2 19,31.43 19.05,31.38
IREF_A_RAW  (via drill 0.3)
  Top 0.152: R41.2 v18.3,35.98 | v38.35,46.88 U11.18
  Bottom 0.152: v18.3,35.98 20.1,35.98 20.13,35.94 27.27,35.94 36.85,45.53 36.98,45.53 38.35,46.9 v38.35,46.88
IREF_B
  Top 0.152: 35.83,31.4 R6.2 | 35.83,31.4 C19.1 | R12.1 35.12,33.88 35.77,33.23 35.77,31.45 35.83,31.4
IREF_B_RAW  (via drill 0.3)
  Top 0.152: R12.2 35.05,35.17 v35.05,35.98 | v38.99,46.44 38.99,48.04 U11.19
  Bottom 0.152: v35.05,35.98 35.05,42.22 37.61,44.78 37.61,44.91 39,46.3 v39,46.43 v38.99,46.44
IREF_C
  Top 0.152: 52.65,31.45 R36.2 | 52.65,31.45 C40.1 | R46.1 51.95,33.92 52.6,33.27 52.6,31.5 52.65,31.45
IREF_C_RAW  (via drill 0.3)
  Top 0.152: R46.2 v51.9,36.02 | v39.65,46.85 U11.20
  Bottom 0.152: v51.9,36.02 50.42,36.02 39.67,46.77 39.67,46.83 v39.65,46.85
N$1
  Top 0.152: IC2.27 38.98,27.8 38.8,27.73 37.55,27.73 C3.2
N$2
  Top 0.254: IC2.14 42.2,32.88 42.45,33.12 42.45,34.98 R3.2
N$3
  Top 0.254: IC2.33 42.2,24.75 R4.2
N$4
  Top 0.152: IC4.1 31.32,33.75 30.82,34.27 30.82,35.45 28.68,37.6 25.88,37.6 25.52,37.95 25.52,38.55 U1.7
N$5
  Top 0.152: IC4.2 30.8,33.08 30.5,33.38 30.5,35.33 28.55,37.27 25.52,37.27 24.88,37.92 U1.6
N$6
  Top 0.152: IC1.18 23.43,33.35 23.12,33.65 23.12,35.6 22.25,36.48 22.25,38.58 U1.2
N$8
  Top 0.152: R45.2 10.9,1.02 LED8.C
N$9
  Bottom 0.305: R51.2 R50.1
N$11  (via drill 0.3)
  Top 0.254: R56.1 v96.8,51.3 L3.1
  Bottom 0.305: R59.2 R52.2 v96.8,51.3
N$12
  Top 0.305: LED2.C 53.3,65.53 53.65,65.88 58.33,65.88 58.55,65.65 58.55,63.99 X1.2 59.97,65.38 Q1.3
N$13
  Top 0.305: LED0.C 40.5,65.53 40.85,65.88 45.52,65.88 45.75,65.65 45.75,63.99 X9.2 47.17,65.38 Q6.3
N$14  (1 unrouted)
N$15  (1 unrouted)
  Top 0.254: L1.2 93.75,53.77
N$16
  Top 0.152: IC1.28 21.62,27.27 C1.1
N$17
  Top 0.152: IC1.27 22.2,27.77 22.02,27.7 20.77,27.7 C1.2
N$18
  Top 0.254: IC1.14 25.43,32.85 25.68,33.1 25.68,34.95 R1.2
N$19
  Top 0.254: IC1.33 25.43,24.73 R2.2
N$20
  Top 0.152: 22.48,29.77 IC1.23 22.45,29.77 21.82,30.4 21.82,30.9 21.57,31.15 21.18,31.15 R49.1 | R49.1 21.05,31.27 | R49.1 C12.1
N$21
  Top 0.305: LED0.A 41.48,63.12 R25.1
N$22
  Top 0.152: 39.25,29.8 IC2.23 39.23,29.8 38.6,30.43 38.6,30.93 38.35,31.18 37.95,31.18 R6.1 | R6.1 37.83,31.3 | R6.1 C10.1
N$23
  Top 0.152: IC2.28 38.4,27.3 C3.1
N$24
  Top 0.152: IC2.25 39.12,28.8 38.88,29.05 38.88,29.48 38.73,29.62 R10.1 C15.2
N$25
  Top 0.305: IC2.29 39.55,26.65 38.9,26 C16.1
N$26
  Top 0.152: IC2.18 40.2,33.38 39.9,33.67 39.9,35.62 39.02,36.5 39.02,38.6 U2.2
N$27
  Top 0.152: U2.1 38.39,37.96 38.7,37.6 38.7,36.38 39.52,35.55 39.52,31.82 IC2.19
N$28
  Top 0.152: IC6.1 48.1,33.77 47.6,34.3 47.6,35.48 45.45,37.62 42.65,37.62 42.3,37.98 42.3,38.58 U2.7
N$29
  Top 0.152: IC6.2 47.58,33.1 47.27,33.4 47.27,35.35 45.33,37.3 42.3,37.3 41.65,37.95 41.65,38.77 U2.6
N$30
  Top 0.152: IC5.2 47,30.18 46.62,30.55 46.62,35.1 45.1,36.62 41.67,36.62 40.35,37.95 U2.4
N$31
  Top 0.152: IC1.25 22.35,28.77 22.1,29.02 22.1,29.45 21.95,29.6 R53.1 C21.2
N$32
  Top 0.152: IC5.1 47.2,30.82 46.95,31.07 46.95,35.23 45.23,36.95 42,36.95 41,37.95 U2.5
N$33
  Top 0.305: IC1.29 22.77,26.62 22.12,25.98 C22.1
N$34
  Top 0.152: IC3.2 30.23,30.15 29.85,30.52 29.85,35.08 28.32,36.6 24.9,36.6 23.57,37.92 U1.4
N$35
  Top 0.152: U2.3 39.7,38.77 39.7,37.95 41.38,36.27 44.98,36.3 46.3,34.98 46.3,30.02 45.58,29.3 IC2.5
N$36
  Top 0.152: IC2.26 38.08,28.3 R10.2 C18.1
N$37
  Top 0.152: IC7.2 36.7,37.83 36.48,38.05 36.48,39.2 39.05,41.77 U2.15
N$38  (1 unrouted)
  Top 0.254: L4.2 84.78,43.55
N$39
  Top 0.254: U3.P$16 88.9,48.44 R7.1 R8.2
N$40
  Top 0.152: IC3.1 30.43,30.8 30.18,31.05 30.18,35.2 28.45,36.92 25.23,36.92 24.23,37.92 U1.5
N$41
  Top 0.254: U4.P$16 79.92,38.22 R13.1 R16.2
N$42  (via drill 0.3)
  Top 0.254: R22.1 v87.83,41.08 L5.1
  Bottom 0.305: R64.2 R63.2 v87.83,41.08
N$43
  Top 0.152: U1.1 21.61,37.94 21.93,37.58 21.93,36.35 22.75,35.52 22.75,31.8 IC1.19
N$44
  Top 0.152: U1.3 22.93,37.92 24.6,36.25 28.2,36.27 29.52,34.95 29.52,30 28.8,29.27 IC1.5
N$45
  Top 0.254: R22.2 C29.2
  Top 0.305: C29.2 U4.P$2
N$46
  Top 0.254: R24.2 C29.1
  Top 0.305: C29.1 U4.P$4
N$47  (1 unrouted)
  Top 0.254: L5.2 88.97,45.65
N$48  (via drill 0.3)
  Top 0.254: R24.1 87.78,42.38 v87.8,42.35 L4.1
  Bottom 0.305: R27.1 87.78,42.38 v87.8,42.35
N$49
  Bottom 0.305: R27.2 R26.1
N$50
  Bottom 0.305: R64.1 92.03,42.52 R65.2
N$51  (1 unrouted)
  Top 0.152: Q3.4 R47.2
N$52
  Top 0.152: IC8.27 55.8,27.85 55.62,27.77 54.38,27.77 C32.2
N$53
  Top 0.152: R30.2 23.93,52.17 R29.1
N$54
  Top 0.254: IC8.14 59.02,32.92 59.27,33.17 59.27,35.02 R31.2
N$55
  Top 0.254: IC8.33 59.02,24.8 R35.2
N$56
  Top 0.152: 56.08,29.85 IC8.23 56.05,29.85 55.42,30.48 55.42,30.98 55.17,31.23 54.77,31.23 R36.1 | R36.1 54.65,31.35 | R36.1 C34.1
N$57
  Top 0.152: IC8.28 55.23,27.35 C32.1
N$58
  Top 0.152: IC8.25 55.95,28.85 55.7,29.1 55.7,29.52 55.55,29.68 R38.1 C37.2
N$59
  Top 0.305: IC8.29 56.38,26.7 55.73,26.05 C38.1
N$60
  Top 0.152: IC8.18 57.02,33.42 56.73,33.73 56.73,35.67 55.85,36.55 55.85,38.66 U7.2
N$61
  Top 0.152: U7.1 55.21,38.01 55.52,37.65 55.52,36.42 56.35,35.6 56.35,31.88 IC8.19
N$62
  Top 0.152: IC10.1 64.92,33.83 64.42,34.35 64.42,35.52 62.27,37.67 59.48,37.67 59.12,38.02 59.12,38.63 U7.7
N$63
  Top 0.152: IC10.2 64.4,33.15 64.1,33.45 64.1,35.4 62.15,37.35 59.12,37.35 58.48,38 U7.6
N$64
  Top 0.152: R57.1 8.25,38.9 9.75,38.9 C57.1 | 9.38,44.15 8.38,44.15 8,44.52
  Top 0.254: LED1.C 9.88,39.15 C57.1 | 8,44.06 8,43.4 Q2.6 | 8,44.52 Q2.5 | 9.75,43.4 9.38,44.15
  Top 0.406: C57.1 9.97,41.14 Q2.7
  Top 2: D3.A 9.38,44.15 8.95,44.23 9.12,44.06
  Top 2.54: X21.2 8,44.06 9.12,44.06
  pour Top (rank 5, no thermals): 6.35,42.8 6.35,42.15 8.03,40.48 10.43,40.48 10.43,42.8 10.43,43.05 6.35,43.05
N$65
  Top 0.152: IC9.2 63.83,30.23 63.45,30.6 63.45,35.15 61.92,36.67 58.5,36.67 57.17,38 U7.4
N$66
  Top 0.152: IC9.1 64.03,30.88 63.77,31.12 63.77,35.27 62.05,37 58.83,37 57.83,38 U7.5
N$67
  Top 0.152: U7.3 56.52,38 58.2,36.33 61.8,36.35 63.12,35.02 63.12,30.07 62.4,29.35 IC8.5
N$68
  Top 0.152: IC8.26 54.9,28.35 R38.2 C39.1
N$69
  Top 0.152: IC11.2 53.52,37.88 53.3,38.1 53.3,39.25 55.88,41.83 U7.15
N$70
  Top 0.254: R56.2 C49.2
  Top 0.305: C49.2 U3.P$2
N$71
  Top 0.254: R58.2 C49.1
  Top 0.305: C49.1 U3.P$4
N$72  (via drill 0.3)
  Top 0.254: R58.1 96.75,52.6 v96.78,52.58 L1.1
  Bottom 0.305: R51.1 96.75,52.6 v96.78,52.58
N$73  (1 unrouted)
  Top 0.152: R48.2 14.88,44.58 Q2.4
N$75
  Bottom 0.305: R59.1 93.62,50.8 R60.2
N$76  (1 unrouted)
  Top 0.152: Q5.1 86.15,63.9 86.53,64.28 89.65,64.28 R33.2
N$77  (1 unrouted)
  Top 0.152: Q4.1 73.38,63.92 73.75,64.3 76.88,64.3 R21.2
N$78
  Top 0.305: LED2.A 54.27,63.12 R5.1
N$79
  Top 0.305: LED5.C 66.08,65.53 66.42,65.88 71.1,65.88 71.33,65.65 71.33,63.99 X4.2 72.75,65.38 Q4.3
N$80
  Top 0.305: LED5.A 67.05,63.12 R20.1
N$81
  Top 0.305: LED6.C 78.85,65.5 79.2,65.85 83.88,65.85 84.1,65.62 84.1,63.97 X5.2 85.52,65.35 Q5.3
N$82
  Top 0.305: LED6.A 79.83,63.1 R32.1
N$83  (1 unrouted)
  Top 0.152: Q1.1 60.6,63.92 60.98,64.3 64.1,64.3 R19.2
N$84  (1 unrouted)
  Top 0.152: Q6.1 47.8,63.92 48.17,64.3 51.3,64.3 R34.2
N$87  (1 unrouted)
  Top 0.254: L6.2 85.08,32.5
N$88
  Top 0.254: U5.P$16 80.22,27.17 R68.1 R69.2
N$89  (via drill 0.3)
  Top 0.254: R70.1 v88.12,30.02 L7.1
  Bottom 0.305: R75.2 R74.2 v88.12,30.02
N$90
  Top 0.254: R70.2 C50.2
  Top 0.305: C50.2 U5.P$2
N$91
  Top 0.254: R71.2 C50.1
  Top 0.305: C50.1 U5.P$4
N$92  (1 unrouted)
  Top 0.254: L7.2 89.28,34.6
N$93  (via drill 0.3)
  Top 0.254: R71.1 88.08,31.32 v88.1,31.3 L6.1
  Bottom 0.305: R73.1 88.08,31.32 v88.1,31.3
N$94
  Bottom 0.305: R73.2 R72.1
N$95
  Bottom 0.305: R75.1 92.33,31.48 R76.2
N$96
  Top 0.254: LED4.A R11.1
N$108
  Top 0.152: IC1.26 21.3,28.27 R53.2 C71.1
N$120
  Top 0.152: IC18.2 19.93,37.8 19.7,38.02 19.7,39.17 22.27,41.75 U1.15
N$123  (1 unrouted)
  Top 0.254: L8.2 85.22,22.3
N$124
  Top 0.254: U6.P$16 80.38,16.97 R79.1 R80.2
N$125  (via drill 0.3)
  Top 0.254: R81.1 v88.28,19.82 L9.1
  Bottom 0.305: R86.2 R85.2 v88.28,19.82
N$126
  Top 0.254: R81.2 C58.2
  Top 0.305: C58.2 U6.P$2
N$127
  Top 0.152: LED3.A 12.25,21.75 12.38,21.62 R15.1
N$128
  Top 0.254: R82.2 C58.1
  Top 0.305: C58.1 U6.P$4
N$129
  Top 0.254: LED1.A 11.38,36.4 R14.1
N$130  (1 unrouted)
  Top 0.254: L9.2 89.42,24.4
N$131  (via drill 0.3)
  Top 0.254: R82.1 88.22,21.12 v88.25,21.1 L8.1
  Bottom 0.305: R84.1 88.22,21.12 v88.25,21.1
N$132
  Bottom 0.305: R84.2 R83.1
N$133
  Bottom 0.305: R86.1 92.47,21.27 R87.2
N$233
  Top 0.254: U10.7 16.55,55.2 15.93,54.58 R43.1 R42.2
N$234
  Top 0.406: C59.1 13.2,30.38 12.53,29.7 D1.A | R55.1 9.5,25.04 Q3.7
  Top 0.5: R55.1 9.5,22.88 LED3.C
  pour Top (rank 5, no thermals): 5.28,27.1 6.88,27.1 8.65,28.88 10.6,28.88 10.6,24 7.95,24 6.88,25.07 5.28,25.07
N$238  (via drill 0.3)
  Top 0.254: C55.2 v19.9,62.17
  Bottom 0.305: v15,60.77 15.1,60.77 16.5,62.17 v19.9,62.17
  pour Top (rank 4, no thermals): 15.93,61.15 15.93,60.2 14.28,60.2 13.78,60.7 13.78,62.65 15.3,61.77
  pour Top (rank 4, no thermals): 11.82,62.65 11.78,62.65 9.88,64.55 9.88,58.77 9.9,58.77 11.82,60.7
N$240
  Top 0.254: X11.2 34.85,64 35.38,64.53 R18.1 R40.1
N$241
  Top 0.152: 26.59,63.98 X7.2
  Top 0.254: X7.2 26.59,64.07 27.2,64.67 R17.1 R39.1
N$243
  Top 0.152: U10.10 C54.1
N$244
  Top 0.152: U10.8 C56.1
N$245
  Top 0.254: U10.2 C55.1
N$246
  Top 0.152: C56.2 R44.1
SER_2  (1 unrouted)
SER_3  (1 unrouted)
SPI1_CS0  (via drill 0.3)  (1 unrouted)
  Top 0.152: P9.27 53.3,59.13 52.3,58.14 52.3,56.57 55.83,53.05 v55.8,53.02 | U7.12 57.85,44.69 v57.85,46.02 57.75,45.92 49.65,45.92 46.92,43.2 41.5,43.2 41.01,43.7 U2.12
  Bottom 0.152: v55.8,53.02 55.8,48.05 57.83,46.02 v57.85,46.02
SPI1_MOSI  (via drill 0.3)
  Top 0.152: U1.14 22.93,45.81 22.95,45.83 v22.95,45.85
  Bottom 0.152: P9.30 43.48,50.46 43.48,46.6 43.17,46.29 42.73,46.29 41.62,47.41 38.13,47.41 36.57,45.85 v22.95,45.85
SPI1_SCLK  (via drill 0.3)  (1 unrouted)
  Top 0.152: U2.11 41.64,45.37 42.92,46.65 42.92,46.8 v42.95,46.83 43.22,46.56 58.07,46.56 58.15,46.48 58.7,46.48 58.47,46.24 U7.11
  Bottom 0.152: P9.31 48.22,59.13 49.21,58.14 49.21,57.32 42.95,51.06 v42.95,46.83
STEP_A  (via drill 0.3)
  Top 0.152: IC1.6 28.48,29.77 v28.52,29.82
  Bottom 0.152: v28.52,29.82 29.87,29.82 30.03,29.98 38.2,29.98 40.25,32.03 46.78,32.03 49.55,34.8 51.86,34.8 52.74,35.68 52.74,54.63 P9.26
STEP_B  (via drill 0.3)
  Top 0.152: IC2.6 45.25,29.8 v45.3,29.85
  Bottom 0.152: P8.7 77.66,11.89 76.58,12.97 46.75,12.97 45.77,13.95 45.77,29.38 v45.3,29.85
STEP_C  (via drill 0.3)
  Top 0.152: IC8.6 62.08,29.85 v62.12,29.9
  Bottom 0.152: v62.12,29.9 62.27,30.04 62.8,30.04 63.11,30.36 63.11,30.95 65.53,33.37 65.53,40.63 67.05,42.15 67.05,58.78 P9.15
THERM_EXT3
  Top 0.254: C46.1 R40.2 37.6,60.73 P9.39
THERM_EXT4
  Top 0.254: R39.2 C45.1 30.62,63.38 32.68,61.31 35.95,61.31 36.56,60.7 36.56,59.23 P9.40
TRISTATE_STEPPERS  (via drill 0.3)
  Top 0.152: v20.35,36.48 IC18.1 | v37.12,36.5 IC7.1 | v53.95,36.55 IC11.1
  GND 0.254: v20.35,36.48 22.48,36.48 22.86,36.09 36.72,36.09 v37.12,36.5 39.25,36.5 39.63,36.12 53.52,36.12 v53.95,36.55
VDD_5V  (via drill 0.3)  (1 unrouted)
  Top 0.152: U11.28 46.44,48.05 C17.1 | U11.5 U11.4 U11.3 U11.2 U11.1
  Top 0.406: v70.62,49 49.75,49 48.67,47.92 46.62,47.92 C17.1
  VCC 0.406: P9.6 81.23,58.9 | 81.23,58.9 P9.5 | 81.23,58.9 78.28,58.9 77.58,58.19 77.58,58.08 77.47,57.98 77.47,55.17 71.3,49 v70.62,49
VDD_12V  (via drill 0.3)
  Top 0.305: R25.2 42.68,64.53 X9.1 | R5.2 55.48,64.53 X1.1 | R20.2 68.25,64.53 X4.1 | R32.2 81.03,64.5 X5.1
  Top 0.406: 3.95,56.6 3.95,58.4 | 3.95,56.6 R11.2 | 3.95,58.4 v5.1,58.23 | 12V.TP 1.6,57.15 2.85,58.4 3.95,58.4 | R42.1 4.67,55.88 3.95,56.6
  other vias: 5.1,63.6 5.1,62.52 5.1,61.45 5.1,60.38 5.1,59.3
  pour Top (rank 4, no thermals): 2.62,67.45 2.62,67.08 4.17,67.08 4.17,67.45
  pour Top (rank 4, no thermals): 2.62,65.33 2.52,65.22 2.52,64.6 4.28,64.6 4.28,65.22 4.17,65.33
  pour Top (rank 4, no thermals): 4.28,64.6 4.97,64.6 5.6,63.98 5.6,57.77 4.97,57.15 4.28,57.15
  pour VCC (isolate 0.305, rank 2): 39.98,66.7 39.98,63.15 32.6,55.77 32.6,53.08 60.95,53.08 63.05,55.17 74.53,55.17 76.67,57.33 76.67,58.23 77.97,59.52 79.83,59.52 83.08,62.77 83.08,66.7
  pour VCC (isolate 0.305, rank 2): 4.38,64.3 4.38,57.67 4.58,57.48 21.18,57.48 25.57,53.08 32.6,53.08 32.6,55.75 27.5,55.75 23.02,60.23 10.1,60.23 6.03,64.3
VDD_ADC  (via drill 0.3)
  Top 0.254: v36.5,62.4 R18.2 | R17.2 v28.25,62.55
  Bottom 0.406: v28.25,62.55 31.34,62.55 31.77,62.12 35.23,62.12 35.51,62.4 v36.5,62.4 42.46,62.4 43.48,61.39 44.56,61.39 44.56,59.81 45.21,59.15 46.79,59.15 P9.32
VDD_IN  (via drill 0.3)
  Top 0.152: D5.C 14.55,13.15 13.6,13.15 13.1,12.65 v13.1,7 | R45.1 7.62,2.23 6.7,3.15 6.7,6.85 v6.8,6.95
  Top 0.254: IC1.16 24.43,33.65 C6.1 | IC2.16 41.2,33.67 C25.1 | IC8.16 58.02,33.73 C44.1
  Top 1.27: D5.C 14.7,13.68 | F1.P$3
  Bottom 0.152: v6.8,6.95 13.05,6.95 v13.1,7
  other vias: 9.75,35 19.27,25.93 24.05,33.4 23.12,21.12 22.1,21.12 21.52,20.2 22.57,20.2 15.3,64.7 15.3,64.08 15.3,63.45 36.05,25.95 40.83,33.42 39.9,21.15 38.88,21.15 38.3,20.23 39.35,20.23 52.88,26 57.65,33.48 56.73,21.2 55.7,21.2 55.12,20.27 56.17,20.27
  pour Top (isolate 0.5, rank 6, no thermals): 13.38,15.35 6.95,15.35 6.95,20.7 0,20.7 0,52.5 13.38,52.5
  pour Bottom (isolate 0.254, rank 6, no thermals): 13.45,69.5 13.45,15.32 7,15.32 7,20.7 0,20.7 0,69.5
  pour Top (rank 5, no thermals): 23.43,24.52 23.43,25.9 23.82,26.3 23.82,26.95 24.52,26.95 24.52,25.85 24.3,25.62 24.3,24.23 24.18,24.1 23,24.1
  pour Top (rank 5, no thermals): 19.05,25.27 19.95,25.27 20.2,25.52 20.2,26.35 19.02,26.35 18.98,26.25 18.98,25.35
  pour Top (rank 5, no thermals): 23.48,33.85 23.48,33.67 23.68,33.48 23.68,33.1 23.73,33.02 24.38,33.02 24.43,33.08 24.43,33.62 24.15,33.9 23.52,33.9
  pour Top (rank 5, no thermals): 24.15,22.65 24.15,20.48 22.93,19.25 20.52,19.25 20.52,20.27 22.9,22.65
  pour Top (rank 5, no thermals): 16.4,61.15 16.7,61.15 16.7,61.33 16.77,61.42 16.95,61.6 16.95,62.73 17.32,63.1 15.78,63.1 15.78,63.08 16.12,62.73 16.12,61.6 16.4,61.33
  pour Top (rank 5, no thermals): 13.72,14.28 12.65,15.35 13.38,15.35 13.38,17.43 14.07,17.43 15.68,15.82 15.68,14.25 13.75,14.25
  pour VCC (isolate 0.305, rank 6, no thermals): 14.3,3.1 14.3,11.45 0,11.45 0,69.55 76,69.55 76,3.1
  pour VCC (rank 4, no thermals): 70.5,14.03 99.9,14.03 99.9,3.1 70.5,3.1
  pour VCC (rank 5, no thermals): 70.53,48.38 77.75,48.38 77.75,58.25 78.1,58.6 78.15,58.65 78.17,58.67 78.2,58.7 79.92,58.7 107.03,58.7 107.03,66.7 70.53,66.7
  pour Top (rank 4, no thermals): 15.78,63.1 15.12,63.1 14.93,63.3 14.93,64.85 15.12,65.05 15.57,65.05 15.78,64.85
  pour Bottom (isolate 0.61, rank 4, no thermals): 15.12,65.15 15.47,65.15 15.75,64.88 15.75,63.27 15.47,63 13.47,63 13.47,65.15
  pour Top (rank 5, no thermals): 40.2,24.55 40.2,25.93 40.6,26.32 40.6,26.98 41.3,26.98 41.3,25.88 41.08,25.65 41.08,24.25 40.95,24.12 39.77,24.12
  pour Top (rank 5, no thermals): 35.83,25.3 36.73,25.3 36.98,25.55 36.98,26.38 35.8,26.38 35.75,26.27 35.75,25.38
  pour Top (rank 5, no thermals): 40.25,33.88 40.25,33.7 40.45,33.5 40.45,33.12 40.5,33.05 41.15,33.05 41.2,33.1 41.2,33.65 40.92,33.92 40.3,33.92
  pour Top (rank 5, no thermals): 40.92,22.68 40.92,20.5 39.7,19.27 37.3,19.27 37.3,20.3 39.67,22.68
  pour Top (rank 5, no thermals): 57.02,24.6 57.02,25.98 57.42,26.38 57.42,27.02 58.12,27.02 58.12,25.93 57.9,25.7 57.9,24.3 57.77,24.18 56.6,24.18
  pour Top (rank 5, no thermals): 52.65,25.35 53.55,25.35 53.8,25.6 53.8,26.43 52.62,26.43 52.58,26.32 52.58,25.43
  pour Top (rank 5, no thermals): 57.08,33.92 57.08,33.75 57.27,33.55 57.27,33.17 57.33,33.1 57.98,33.1 58.02,33.15 58.02,33.7 57.75,33.98 57.12,33.98
  pour Top (rank 5, no thermals): 57.75,22.73 57.75,20.55 56.52,19.32 54.12,19.32 54.12,20.35 56.5,22.73
VIN
  Top 1.27: 4.5,5.62 4,5.25
  Top 2: X2.3 4,5.25 X2.4
  pour Top (no thermals): 0,10.5 13.38,10.5 13.38,0 0,0
  pour VCC (no thermals): 0.3,10.6 13.45,10.6 13.45,0.45 0.3,0.45
X_A1  (via drill 0.3)
  VCC 0.508: X14.2 26.45,25.38 v26.1,25.73 v26.8,25.73
  pour Top (rank 4, no thermals): 25.82,26.3 25.82,26.15 25.73,26.05 25.73,25.45 25.8,25.38 27.07,25.38 27.15,25.45 27.15,26 27.05,26.1 26.2,26.1 26.02,26.3
X_A2
  Top 0.508: X14.1 28.98,12.89 24.85,17.02 24.85,23.8
  pour Top (rank 4, no thermals): 25.1,23.38 25.1,26.2 25.02,26.3 24.82,26.3 24.75,26.23 24.75,26.07 24.73,26.02 24.73,25.75 24.6,25.52 24.6,23 24.75,23
X_B1  (via drill 0.3)
  VCC 0.508: X14.3 23.91,6.86 25.6,8.55 25.6,25.01 25.24,25.37 25.24,26.08 25.92,26.76 26.83,26.76 27.34,27.27 27.34,31.83 26.3,32.87 v26.3,33.3 v26.3,33.92
  pour Top (rank 4, no thermals): 26.02,32.75 26.02,32.77 26.25,33 26.43,33 26.62,33.2 26.62,34.02 26.43,34.23 26.18,34.23 26,34.05 26,33 25.82,32.75
X_B2  (via drill 0.3)
  VCC 0.508: 21.85,5.78 X14.4 21.6,5.78 24.73,8.9 24.73,24.73 23.01,26.44 23.01,31.83 23.52,32.34 24.2,32.34 24.91,33.04 24.91,33.24 v25.05,33.38 25.05,33.88 v24.95,33.98
  pour Top (rank 4, no thermals): 24.82,32.75 24.82,32.88 24.75,32.95 24.75,33.7 24.62,33.92 24.7,34.25 25.25,34.25 25.3,33.62 25.35,33.35 25.27,33.17 25.15,33.08 25.07,33 25.02,32.75
X_CFG1
  Top 0.152: IC1.4 31.77,28.77 32.05,29.05 32.05,31.88 32.45,32.27 32.88,32.27 IC4.4
X_CFG2
  Top 0.152: IC1.3 28.12,28.27 28.3,28.45 31.93,28.45 32.42,28.95 32.58,28.95 IC3.4
X_CFG3
  Top 0.152: IC2.3 44.9,28.3 45.08,28.48 48.7,28.48 49.2,28.98 49.35,28.98 IC5.4
X_CFG4
  Top 0.152: IC2.4 48.55,28.8 48.83,29.07 48.83,31.9 49.23,32.3 49.65,32.3 IC6.4
X_CFG5
  Top 0.152: IC8.3 61.73,28.35 61.9,28.52 65.53,28.52 66.03,29.02 66.17,29.02 IC9.4
X_CFG6
  Top 0.152: IC8.4 65.38,28.85 65.65,29.12 65.65,31.95 66.05,32.35 66.47,32.35 IC10.4

## Text on the board
Document: Thermistors | HBP | End stops | PWM | E | ++12..24V -- | Steppers | Steppers | Steppers | 20 A | A | A | B | A | C | reach | Rev B0 | Fuse blown
tDocu: Fuse | 20A